# Altium project FR1_Antenna_Array.PrjPcb
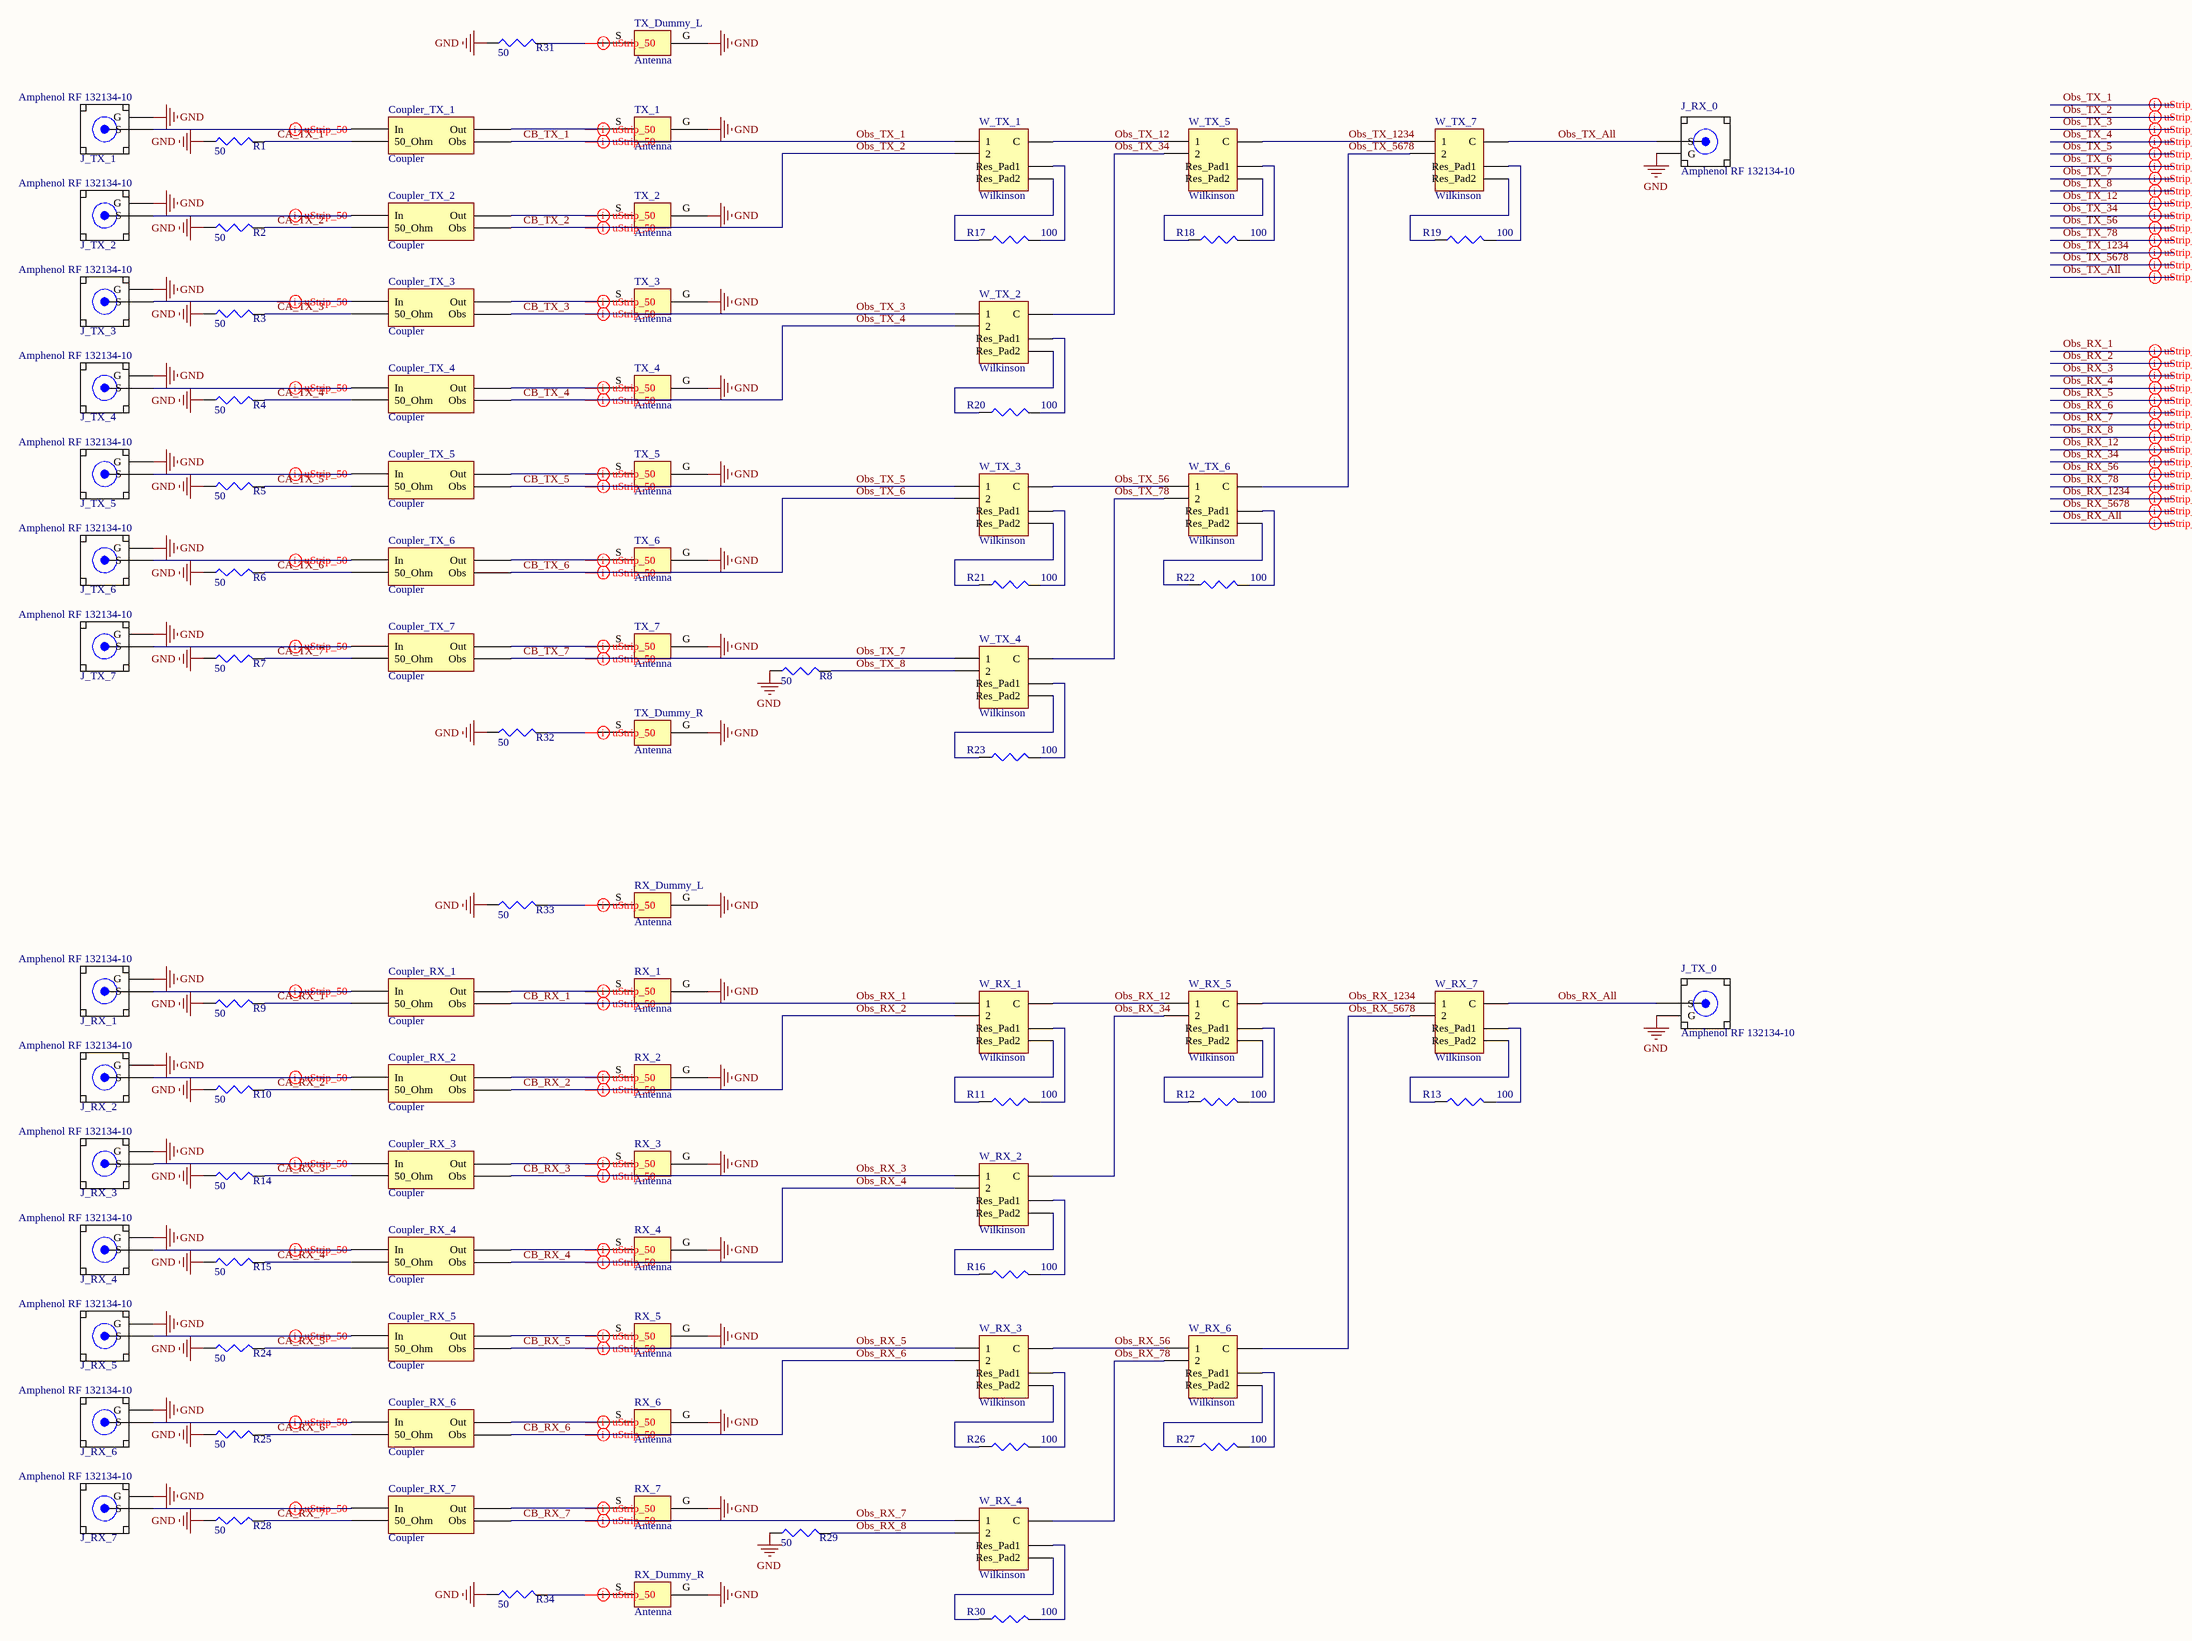
[diagram p0: Main.SchDoc]
1 sheet, 96 parts. Net scope: global (net labels, ports and power ports of the same name join across sheets).
Board file: Main.PcbDoc

## Sheet Main.SchDoc
size C; SheetNumber: 1; SheetTotal: 1

### Parts
Coupler_RX_1  Coupler  [Coupler_v1]  (net tie, no BOM)
Coupler_RX_2  Coupler  [Coupler_v1]  (net tie, no BOM)
Coupler_RX_3  Coupler  [Coupler_v1]  (net tie, no BOM)
Coupler_RX_4  Coupler  [Coupler_v1]  (net tie, no BOM)
Coupler_RX_5  Coupler  [Coupler_v1]  (net tie, no BOM)
Coupler_RX_6  Coupler  [Coupler_v1]  (net tie, no BOM)
Coupler_RX_7  Coupler  [Coupler_v1]  (net tie, no BOM)
Coupler_TX_1  Coupler  [Coupler_v1]  (net tie, no BOM)
Coupler_TX_2  Coupler  [Coupler_v1]  (net tie, no BOM)
Coupler_TX_3  Coupler  [Coupler_v1]  (net tie, no BOM)
Coupler_TX_4  Coupler  [Coupler_v1]  (net tie, no BOM)
Coupler_TX_5  Coupler  [Coupler_v1]  (net tie, no BOM)
Coupler_TX_6  Coupler  [Coupler_v1]  (net tie, no BOM)
Coupler_TX_7  Coupler  [Coupler_v1]  (net tie, no BOM)
J_RX_0  Amphenol RF 132134-10  [Amphenol RF 132134-10 uStrip 9.4mil width]
J_RX_1  Amphenol RF 132134-10  [Amphenol RF 132134-10 uStrip 9.4mil width]
J_RX_2  Amphenol RF 132134-10  [Amphenol RF 132134-10 uStrip 9.4mil width]
J_RX_3  Amphenol RF 132134-10  [Amphenol RF 132134-10 uStrip 9.4mil width]
J_RX_4  Amphenol RF 132134-10  [Amphenol RF 132134-10 uStrip 9.4mil width]
J_RX_5  Amphenol RF 132134-10  [Amphenol RF 132134-10 uStrip 9.4mil width]
J_RX_6  Amphenol RF 132134-10  [Amphenol RF 132134-10 uStrip 9.4mil width]
J_RX_7  Amphenol RF 132134-10  [Amphenol RF 132134-10 uStrip 9.4mil width]
J_TX_0  Amphenol RF 132134-10  [Amphenol RF 132134-10 uStrip 9.4mil width]
J_TX_1  Amphenol RF 132134-10  [Amphenol RF 132134-10 uStrip 9.4mil width]
J_TX_2  Amphenol RF 132134-10  [Amphenol RF 132134-10 uStrip 9.4mil width]
J_TX_3  Amphenol RF 132134-10  [Amphenol RF 132134-10 uStrip 9.4mil width]
J_TX_4  Amphenol RF 132134-10  [Amphenol RF 132134-10 uStrip 9.4mil width]
J_TX_5  Amphenol RF 132134-10  [Amphenol RF 132134-10 uStrip 9.4mil width]
J_TX_6  Amphenol RF 132134-10  [Amphenol RF 132134-10 uStrip 9.4mil width]
J_TX_7  Amphenol RF 132134-10  [Amphenol RF 132134-10 uStrip 9.4mil width]
R1  50  [SMD-0402]
R2  50  [SMD-0402]
R3  50  [SMD-0402]
R4  50  [SMD-0402]
R5  50  [SMD-0402]
R6  50  [SMD-0402]
R7  50  [SMD-0402]
R8  50  [SMD-0402]
R9  50  [SMD-0402]
R10  50  [SMD-0402]
R11  100  [SMD-0402]
R12  100  [SMD-0402]
R13  100  [SMD-0402]
R14  50  [SMD-0402]
R15  50  [SMD-0402]
R16  100  [SMD-0402]
R17  100  [SMD-0402]
R18  100  [SMD-0402]
R19  100  [SMD-0402]
R20  100  [SMD-0402]
R21  100  [SMD-0402]
R22  100  [SMD-0402]
R23  100  [SMD-0402]
R24  50  [SMD-0402]
R25  50  [SMD-0402]
R26  100  [SMD-0402]
R27  100  [SMD-0402]
R28  50  [SMD-0402]
R29  50  [SMD-0402]
R30  100  [SMD-0402]
R31  50  [SMD-0402]
R32  50  [SMD-0402]
R33  50  [SMD-0402]
R34  50  [SMD-0402]
RX_1  Antenna  [Antenna_v1]  (net tie, no BOM)
RX_2  Antenna  [Antenna_v1]  (net tie, no BOM)
RX_3  Antenna  [Antenna_v1]  (net tie, no BOM)
RX_4  Antenna  [Antenna_v1]  (net tie, no BOM)
RX_5  Antenna  [Antenna_v1]  (net tie, no BOM)
RX_6  Antenna  [Antenna_v1]  (net tie, no BOM)
RX_7  Antenna  [Antenna_v1]  (net tie, no BOM)
RX_Dummy_L  Antenna  [Antenna_v1]  (net tie, no BOM)
RX_Dummy_R  Antenna  [Antenna_v1]  (net tie, no BOM)
TX_1  Antenna  [Antenna_v1]  (net tie, no BOM)
TX_2  Antenna  [Antenna_v1]  (net tie, no BOM)
TX_3  Antenna  [Antenna_v1]  (net tie, no BOM)
TX_4  Antenna  [Antenna_v1]  (net tie, no BOM)
TX_5  Antenna  [Antenna_v1]  (net tie, no BOM)
TX_6  Antenna  [Antenna_v1]  (net tie, no BOM)
TX_7  Antenna  [Antenna_v1]  (net tie, no BOM)
TX_Dummy_L  Antenna  [Antenna_v1]  (net tie, no BOM)
TX_Dummy_R  Antenna  [Antenna_v1]  (net tie, no BOM)
W_RX_1  Wilkinson  [Wilkinson_v1]  (net tie, no BOM)
W_RX_2  Wilkinson  [Wilkinson_v1]  (net tie, no BOM)
W_RX_3  Wilkinson  [Wilkinson_v1]  (net tie, no BOM)
W_RX_4  Wilkinson  [Wilkinson_v1]  (net tie, no BOM)
W_RX_5  Wilkinson  [Wilkinson_v1]  (net tie, no BOM)
W_RX_6  Wilkinson  [Wilkinson_v1]  (net tie, no BOM)
W_RX_7  Wilkinson  [Wilkinson_v1]  (net tie, no BOM)
W_TX_1  Wilkinson  [Wilkinson_v1]  (net tie, no BOM)
W_TX_2  Wilkinson  [Wilkinson_v1]  (net tie, no BOM)
W_TX_3  Wilkinson  [Wilkinson_v1]  (net tie, no BOM)
W_TX_4  Wilkinson  [Wilkinson_v1]  (net tie, no BOM)
W_TX_5  Wilkinson  [Wilkinson_v1]  (net tie, no BOM)
W_TX_6  Wilkinson  [Wilkinson_v1]  (net tie, no BOM)
W_TX_7  Wilkinson  [Wilkinson_v1]  (net tie, no BOM)

### Nets
GND: J_RX_0.G J_RX_1.G J_RX_2.G J_RX_3.G J_RX_4.G J_RX_5.G J_RX_6.G J_RX_7.G J_TX_0.G J_TX_1.G J_TX_2.G J_TX_3.G J_TX_4.G J_TX_5.G J_TX_6.G J_TX_7.G R1.1 R2.1 R3.1 R4.1 R5.1 R6.1 R7.1 R8.1 R9.1 R10.1 R14.1 R15.1 R24.1 R25.1 R28.1 R29.1 R31.1 R32.1 R33.1 R34.1 RX_1.G RX_2.G RX_3.G RX_4.G RX_5.G RX_6.G RX_7.G RX_Dummy_L.G RX_Dummy_R.G TX_1.G TX_2.G TX_3.G TX_4.G TX_5.G TX_6.G TX_7.G TX_Dummy_L.G TX_Dummy_R.G
CA_RX_1: Coupler_RX_1.50_Ohm R9.2
CA_RX_2: Coupler_RX_2.50_Ohm R10.2
CA_RX_3: Coupler_RX_3.50_Ohm R14.2
CA_RX_4: Coupler_RX_4.50_Ohm R15.2
CA_RX_5: Coupler_RX_5.50_Ohm R24.2
CA_RX_6: Coupler_RX_6.50_Ohm R25.2
CA_RX_7: Coupler_RX_7.50_Ohm R28.2
CA_TX_1: Coupler_TX_1.50_Ohm R1.2
CA_TX_2: Coupler_TX_2.50_Ohm R2.2
CA_TX_3: Coupler_TX_3.50_Ohm R3.2
CA_TX_4: Coupler_TX_4.50_Ohm R4.2
CA_TX_5: Coupler_TX_5.50_Ohm R5.2
CA_TX_6: Coupler_TX_6.50_Ohm R6.2
CA_TX_7: Coupler_TX_7.50_Ohm R7.2
CB_RX_1: Coupler_RX_1.Obs W_RX_1.1  [also labelled Obs_RX_1]
CB_RX_2: Coupler_RX_2.Obs W_RX_1.2  [also labelled Obs_RX_2]
CB_RX_3: Coupler_RX_3.Obs W_RX_2.1  [also labelled Obs_RX_3]
CB_RX_4: Coupler_RX_4.Obs W_RX_2.2  [also labelled Obs_RX_4]
CB_RX_5: Coupler_RX_5.Obs W_RX_3.1  [also labelled Obs_RX_5]
CB_RX_6: Coupler_RX_6.Obs W_RX_3.2  [also labelled Obs_RX_6]
CB_RX_7: Coupler_RX_7.Obs W_RX_4.1  [also labelled Obs_RX_7]
CB_TX_1: Coupler_TX_1.Obs W_TX_1.1  [also labelled Obs_TX_1]
CB_TX_2: Coupler_TX_2.Obs W_TX_1.2  [also labelled Obs_TX_2]
CB_TX_3: Coupler_TX_3.Obs W_TX_2.1  [also labelled Obs_TX_3]
CB_TX_4: Coupler_TX_4.Obs W_TX_2.2  [also labelled Obs_TX_4]
CB_TX_5: Coupler_TX_5.Obs W_TX_3.1  [also labelled Obs_TX_5]
CB_TX_6: Coupler_TX_6.Obs W_TX_3.2  [also labelled Obs_TX_6]
CB_TX_7: Coupler_TX_7.Obs W_TX_4.1  [also labelled Obs_TX_7]
Obs_RX_8: R29.2 W_RX_4.2
Obs_RX_12: W_RX_1.C W_RX_5.1
Obs_RX_34: W_RX_2.C W_RX_5.2
Obs_RX_56: W_RX_3.C W_RX_6.1
Obs_RX_78: W_RX_4.C W_RX_6.2
Obs_RX_1234: W_RX_5.C W_RX_7.1
Obs_RX_5678: W_RX_6.C W_RX_7.2
Obs_RX_All: J_TX_0.S W_RX_7.C
Obs_TX_8: R8.2 W_TX_4.2
Obs_TX_12: W_TX_1.C W_TX_5.1
Obs_TX_34: W_TX_2.C W_TX_5.2
Obs_TX_56: W_TX_3.C W_TX_6.1
Obs_TX_78: W_TX_4.C W_TX_6.2
Obs_TX_1234: W_TX_5.C W_TX_7.1
Obs_TX_5678: W_TX_6.C W_TX_7.2
Obs_TX_All: J_RX_0.S W_TX_7.C
NetCoupler_RX_1_In: Coupler_RX_1.In J_RX_1.S
NetCoupler_RX_1_Out: Coupler_RX_1.Out RX_1.S
NetCoupler_RX_2_In: Coupler_RX_2.In J_RX_2.S
NetCoupler_RX_2_Out: Coupler_RX_2.Out RX_2.S
NetCoupler_RX_3_In: Coupler_RX_3.In J_RX_3.S
NetCoupler_RX_3_Out: Coupler_RX_3.Out RX_3.S
NetCoupler_RX_4_In: Coupler_RX_4.In J_RX_4.S
NetCoupler_RX_4_Out: Coupler_RX_4.Out RX_4.S
NetCoupler_RX_5_In: Coupler_RX_5.In J_RX_5.S
NetCoupler_RX_5_Out: Coupler_RX_5.Out RX_5.S
NetCoupler_RX_6_In: Coupler_RX_6.In J_RX_6.S
NetCoupler_RX_6_Out: Coupler_RX_6.Out RX_6.S
NetCoupler_RX_7_In: Coupler_RX_7.In J_RX_7.S
NetCoupler_RX_7_Out: Coupler_RX_7.Out RX_7.S
NetCoupler_TX_1_In: Coupler_TX_1.In J_TX_1.S
NetCoupler_TX_1_Out: Coupler_TX_1.Out TX_1.S
NetCoupler_TX_2_In: Coupler_TX_2.In J_TX_2.S
NetCoupler_TX_2_Out: Coupler_TX_2.Out TX_2.S
NetCoupler_TX_3_In: Coupler_TX_3.In J_TX_3.S
NetCoupler_TX_3_Out: Coupler_TX_3.Out TX_3.S
NetCoupler_TX_4_In: Coupler_TX_4.In J_TX_4.S
NetCoupler_TX_4_Out: Coupler_TX_4.Out TX_4.S
NetCoupler_TX_5_In: Coupler_TX_5.In J_TX_5.S
NetCoupler_TX_5_Out: Coupler_TX_5.Out TX_5.S
NetCoupler_TX_6_In: Coupler_TX_6.In J_TX_6.S
NetCoupler_TX_6_Out: Coupler_TX_6.Out TX_6.S
NetCoupler_TX_7_In: Coupler_TX_7.In J_TX_7.S
NetCoupler_TX_7_Out: Coupler_TX_7.Out TX_7.S
NetR11_1: R11.1 W_RX_1.Res_Pad2
NetR11_2: R11.2 W_RX_1.Res_Pad1
NetR12_1: R12.1 W_RX_5.Res_Pad2
NetR12_2: R12.2 W_RX_5.Res_Pad1
NetR13_1: R13.1 W_RX_7.Res_Pad2
NetR13_2: R13.2 W_RX_7.Res_Pad1
NetR16_1: R16.1 W_RX_2.Res_Pad2
NetR16_2: R16.2 W_RX_2.Res_Pad1
NetR17_1: R17.1 W_TX_1.Res_Pad2
NetR17_2: R17.2 W_TX_1.Res_Pad1
NetR18_1: R18.1 W_TX_5.Res_Pad2
NetR18_2: R18.2 W_TX_5.Res_Pad1
NetR19_1: R19.1 W_TX_7.Res_Pad2
NetR19_2: R19.2 W_TX_7.Res_Pad1
NetR20_1: R20.1 W_TX_2.Res_Pad2
NetR20_2: R20.2 W_TX_2.Res_Pad1
NetR21_1: R21.1 W_TX_3.Res_Pad2
NetR21_2: R21.2 W_TX_3.Res_Pad1
NetR22_1: R22.1 W_TX_6.Res_Pad2
NetR22_2: R22.2 W_TX_6.Res_Pad1
NetR23_1: R23.1 W_TX_4.Res_Pad2
NetR23_2: R23.2 W_TX_4.Res_Pad1
NetR26_1: R26.1 W_RX_3.Res_Pad2
NetR26_2: R26.2 W_RX_3.Res_Pad1
NetR27_1: R27.1 W_RX_6.Res_Pad2
NetR27_2: R27.2 W_RX_6.Res_Pad1
NetR30_1: R30.1 W_RX_4.Res_Pad2
NetR30_2: R30.2 W_RX_4.Res_Pad1
NetR31_2: R31.2 TX_Dummy_L.S
NetR32_2: R32.2 TX_Dummy_R.S
NetR33_2: R33.2 RX_Dummy_L.S
NetR34_2: R34.2 RX_Dummy_R.S

### Layout directives
net class uStrip_50: CB_RX_1, CB_RX_2, CB_RX_3, CB_RX_4, CB_RX_5, CB_RX_6, CB_RX_7, CB_TX_1, CB_TX_2, CB_TX_3, CB_TX_4, CB_TX_5, CB_TX_6, CB_TX_7, NetCoupler_RX_1_In, NetCoupler_RX_1_Out, NetCoupler_RX_2_In, NetCoupler_RX_2_Out, NetCoupler_RX_3_In, NetCoupler_RX_3_Out, NetCoupler_RX_4_In, NetCoupler_RX_4_Out, NetCoupler_RX_5_In, NetCoupler_RX_5_Out, NetCoupler_RX_6_In, NetCoupler_RX_6_Out, NetCoupler_RX_7_In, NetCoupler_RX_7_Out, NetCoupler_TX_1_In, NetCoupler_TX_1_Out, NetCoupler_TX_2_In, NetCoupler_TX_2_Out, NetCoupler_TX_3_In, NetCoupler_TX_3_Out, NetCoupler_TX_4_In, NetCoupler_TX_4_Out, NetCoupler_TX_5_In, NetCoupler_TX_5_Out, NetCoupler_TX_6_In, NetCoupler_TX_6_Out, NetCoupler_TX_7_In, NetCoupler_TX_7_Out, NetR31_2, NetR32_2, NetR33_2, NetR34_2, Obs_RX_8, Obs_RX_12, Obs_RX_34, Obs_RX_56, Obs_RX_78, Obs_RX_1234, Obs_RX_5678, Obs_RX_All, Obs_TX_8, Obs_TX_12, Obs_TX_34, Obs_TX_56, Obs_TX_78, Obs_TX_1234, Obs_TX_5678, Obs_TX_All

### Library data of the parts
J_RX_0-J_RX_7 J_TX_0-J_TX_7 = Amphenol RF 132134-10: RF / Coaxial Connector, SMA Coaxial, Straight Jack, Surface Mount Vertical, 50 ohm; MF: Samtec; MP: SMA-J-P-H-ST-EM1; Price: None; SnapEDA_Link: https://www.snapeda.com/parts/SMA-J-P-H-ST-EM1/Samtec%20Inc./view-part/?ref=snap; Package: None; Availability: Unavailable; Value: *
R1-R34 = RES0402: Resistor-0402